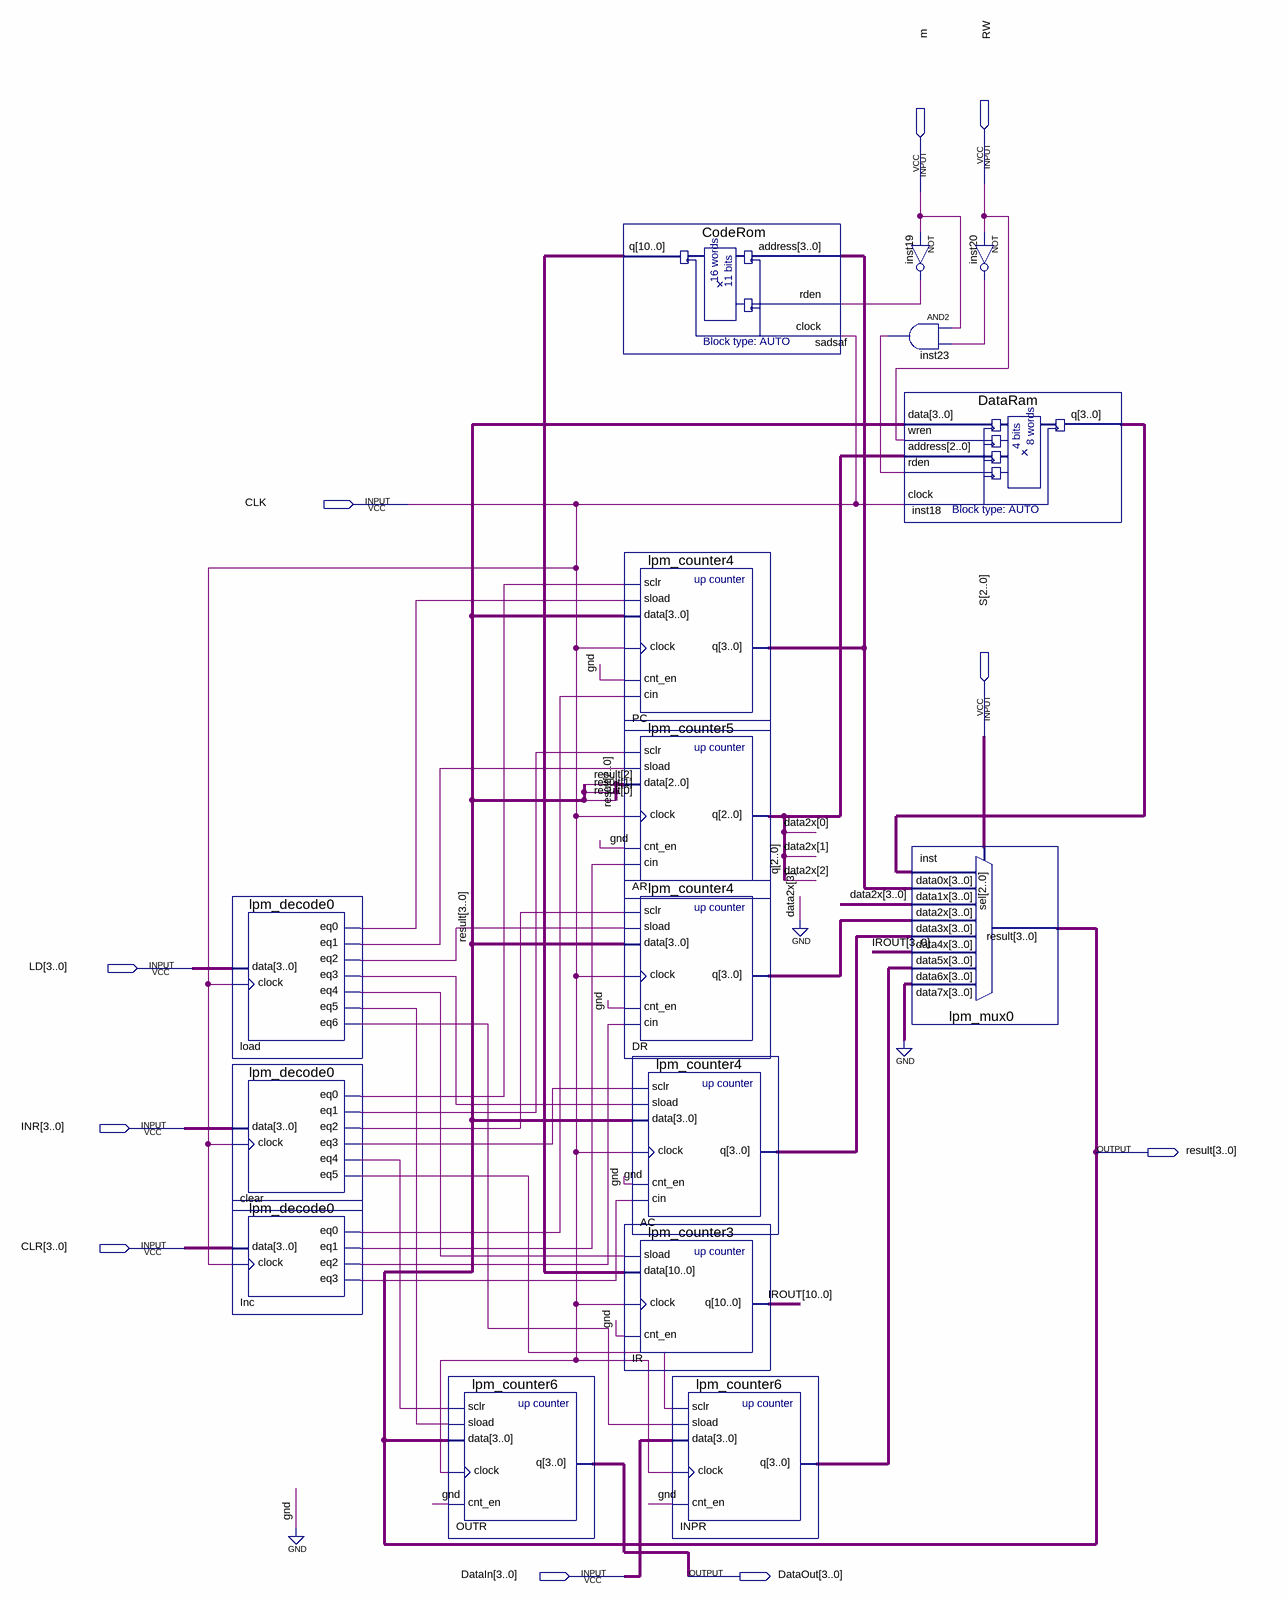
[diagram p0: schematic sheet]
// Quartus schematic Common_Bus_System.bdf as structural Verilog: 16 symbols, 10 pins
module Common_Bus_System (
  input  RW,
  input  m,
  input  CLK,
  input  [2:0] S,
  input  [3:0] LD,
  input  [3:0] INR,
  input  [3:0] CLR,
  input  [3:0] DataIn,
  output [3:0] result,
  output [3:0] DataOut
);

  wire clear_eq0, clear_eq1, clear_eq2, clear_eq3, clear_eq4, clear_eq5, Inc_eq0, Inc_eq1, Inc_eq2, Inc_eq3,
       inst19_out, inst20_out, inst23_out, load_eq0, load_eq1, load_eq2, load_eq3, load_eq4, load_eq5,
       load_eq6;
  wire [2:0] data2x, q;
  wire [3:0] AC_q, DR_q, INPR_q, inst18_q, PC_q;
  wire [10:0] IROUT, sadsaf_q;

  lpm_decode0 load (
    .data(LD), .clock(CLK), .eq0(load_eq0), .eq1(load_eq1), .eq2(load_eq2), .eq3(load_eq3), .eq4(load_eq4),
    .eq5(load_eq5), .eq6(load_eq6));
  lpm_decode0 clear (
    .data(INR), .clock(CLK), .eq0(clear_eq0), .eq1(clear_eq1), .eq2(clear_eq2), .eq3(clear_eq3),
    .eq4(clear_eq4), .eq5(clear_eq5));
  lpm_decode0 Inc (.data(CLR), .clock(CLK), .eq0(Inc_eq0), .eq1(Inc_eq1), .eq2(Inc_eq2), .eq3(Inc_eq3));
  lpm_counter6 OUTR (.sclr(clear_eq4), .sload(load_eq5), .data(result), .clock(CLK), .cnt_en(1'b0), .q(DataOut));
  CodeRom sadsaf (.address(PC_q), .rden(inst19_out), .clock(CLK), .q(sadsaf_q));
  lpm_counter4 PC (
    .sclr(clear_eq0), .sload(load_eq0), .data(result), .clock(CLK), .cnt_en(1'b0), .cin(Inc_eq0), .q(PC_q));
  lpm_counter5 AR (
    .sclr(clear_eq1), .sload(load_eq1), .data(result[2:0]), .clock(CLK), .cnt_en(1'b0), .cin(Inc_eq1), .q(q));
  lpm_counter4 DR (
    .sclr(clear_eq2), .sload(load_eq2), .data(result), .clock(CLK), .cnt_en(1'b0), .cin(Inc_eq2), .q(DR_q));
  lpm_counter4 AC (
    .sclr(clear_eq3), .sload(load_eq3), .data(result), .clock(CLK), .cnt_en(1'b0), .cin(Inc_eq3), .q(AC_q));
  lpm_counter3 IR (.sload(load_eq4), .data(sadsaf_q), .clock(CLK), .cnt_en(1'b0), .q(IROUT));
  lpm_counter6 INPR (.sclr(clear_eq5), .sload(load_eq6), .data(DataIn), .clock(CLK), .cnt_en(1'b0), .q(INPR_q));
  not inst19 (inst19_out, m);
  and inst23 (inst23_out, m, inst20_out);
  DataRam inst18 (.data(result), .wren(RW), .address(q), .rden(inst23_out), .clock(CLK), .q(inst18_q));
  lpm_mux0 inst (
    .data7x(4'b0000), .data6x(INPR_q), .data5x(IROUT[3:0]), .data4x(AC_q), .data3x(DR_q),
    .data2x({1'b0, data2x}), .data1x(PC_q), .data0x(inst18_q), .sel(S), .result(result));
  not inst20 (inst20_out, RW);
endmodule
